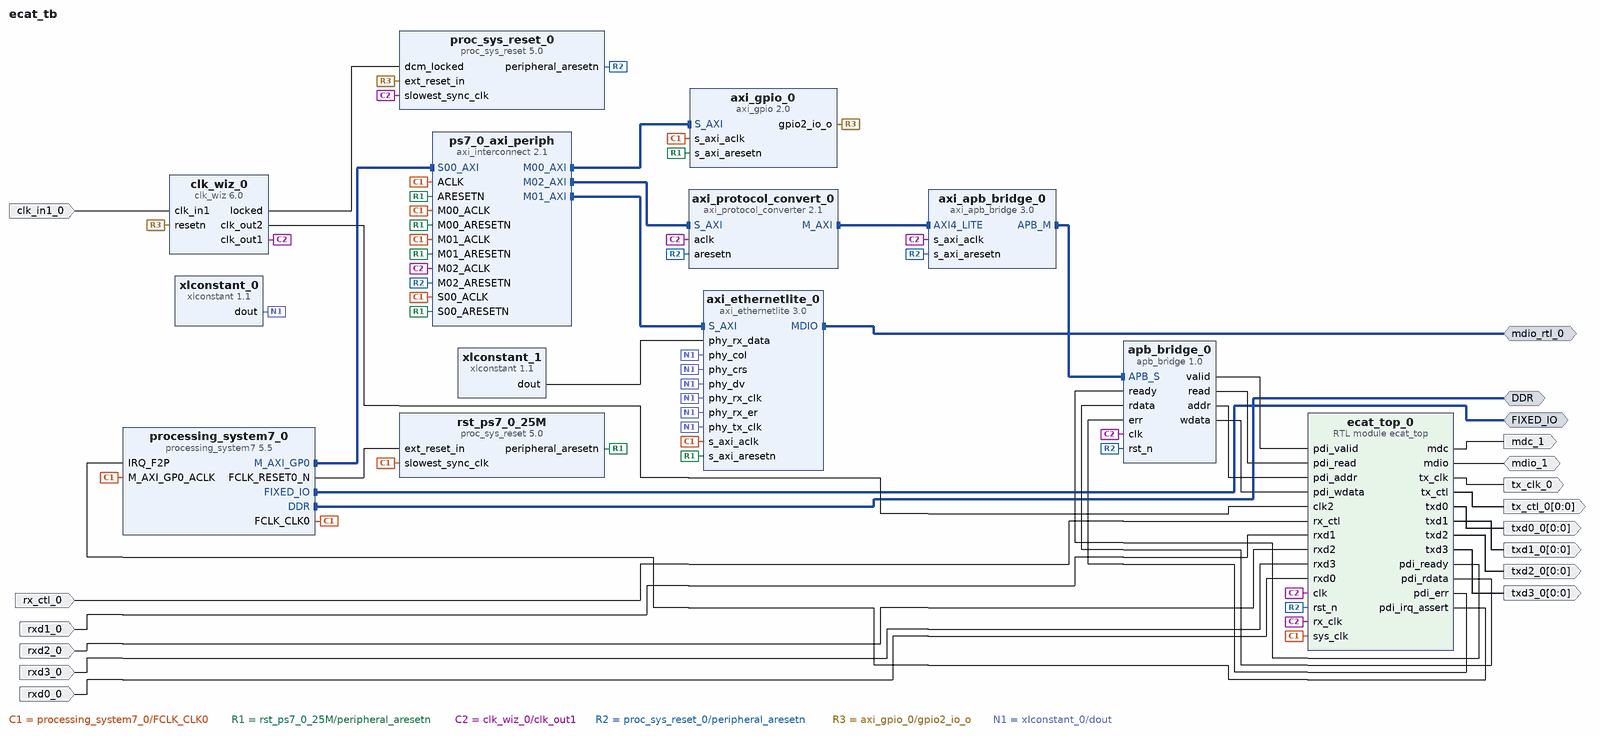
[diagram p0: block diagram of the top level]
# Vivado block design ecat_tb, xc7z020clg400-2, Vivado 2019.1
create_bd_design ecat_tb

create_bd_intf_port -mode Master -vlnv xilinx.com:interface:ddrx_rtl:1.0 DDR
create_bd_intf_port -mode Master -vlnv xilinx.com:display_processing_system7:fixedio_rtl:1.0 FIXED_IO
create_bd_intf_port -mode Master -vlnv xilinx.com:interface:mdio_rtl:1.0 mdio_rtl_0
create_bd_port -dir I -type clk clk_in1_0
set_property -dict {CONFIG.FREQ_HZ 25000000} [get_bd_ports clk_in1_0]
create_bd_port -dir I rx_ctl_0
create_bd_port -dir I rxd0_0
create_bd_port -dir I rxd1_0
create_bd_port -dir I rxd2_0
create_bd_port -dir I rxd3_0
create_bd_port -dir O -type clk tx_clk_0
create_bd_port -dir O -from 0 -to 0 tx_ctl_0
create_bd_port -dir O -from 0 -to 0 txd0_0
create_bd_port -dir O -from 0 -to 0 txd1_0
create_bd_port -dir O -from 0 -to 0 txd2_0
create_bd_port -dir O -from 0 -to 0 txd3_0
create_bd_port -dir O mdc_1
create_bd_port -dir IO mdio_1

create_bd_cell -type ip -vlnv xilinx.com:ip:processing_system7:5.5 processing_system7_0
set_property -dict [list \
  CONFIG.PCW_FPGA0_PERIPHERAL_FREQMHZ 25 \
  CONFIG.PCW_IRQ_F2P_INTR 1 \
  CONFIG.PCW_PRESET_BANK1_VOLTAGE {LVCMOS 1.8V} \
  CONFIG.PCW_UART1_PERIPHERAL_ENABLE 1 \
  CONFIG.PCW_UART1_UART1_IO {MIO 48 .. 49} \
  CONFIG.PCW_UART_PERIPHERAL_FREQMHZ 100 \
  CONFIG.PCW_UIPARAM_DDR_PARTNO {MT41K256M16 RE-125} \
  CONFIG.PCW_USE_FABRIC_INTERRUPT 1 \
] [get_bd_cells processing_system7_0]
# 41 more settings of processing_system7_0 are not shown: defaults, MIO pin electricals, DDR timing, and values the tool derives
create_bd_cell -type ip -vlnv xilinx.com:ip:axi_gpio:2.0 axi_gpio_0
set_property -dict [list \
  CONFIG.C_ALL_OUTPUTS 1 \
  CONFIG.C_ALL_OUTPUTS_2 1 \
  CONFIG.C_GPIO2_WIDTH 1 \
  CONFIG.C_GPIO_WIDTH 1 \
  CONFIG.C_IS_DUAL 1 \
] [get_bd_cells axi_gpio_0]
create_bd_cell -type ip -vlnv xilinx.com:ip:axi_interconnect:2.1 ps7_0_axi_periph
set_property -dict {CONFIG.NUM_MI 3} [get_bd_cells ps7_0_axi_periph]
create_bd_cell -type ip -vlnv xilinx.com:ip:proc_sys_reset:5.0 rst_ps7_0_25M
create_bd_cell -type ip -vlnv xilinx.com:ip:clk_wiz:6.0 clk_wiz_0
set_property -dict [list \
  CONFIG.CLKIN1_JITTER_PS 400.0 \
  CONFIG.CLKOUT1_DRIVES BUFG \
  CONFIG.CLKOUT1_JITTER 432.605 \
  CONFIG.CLKOUT1_PHASE_ERROR 258.220 \
  CONFIG.CLKOUT1_REQUESTED_OUT_FREQ 25 \
  CONFIG.CLKOUT2_DRIVES BUFG \
  CONFIG.CLKOUT2_JITTER 342.952 \
  CONFIG.CLKOUT2_PHASE_ERROR 258.220 \
  CONFIG.CLKOUT2_REQUESTED_OUT_FREQ 50 \
  CONFIG.CLKOUT2_USED true \
  CONFIG.CLKOUT3_DRIVES BUFG \
  CONFIG.CLKOUT3_JITTER 206.578 \
  CONFIG.CLKOUT3_PHASE_ERROR 237.727 \
  CONFIG.CLKOUT3_REQUESTED_OUT_FREQ 200 \
  CONFIG.CLKOUT3_USED false \
  CONFIG.CLKOUT4_DRIVES BUFG \
  CONFIG.CLKOUT5_DRIVES BUFG \
  CONFIG.CLKOUT6_DRIVES BUFG \
  CONFIG.CLKOUT7_DRIVES BUFG \
  CONFIG.MMCM_BANDWIDTH OPTIMIZED \
  CONFIG.MMCM_CLKFBOUT_MULT_F 34 \
  CONFIG.MMCM_CLKIN1_PERIOD 40.000 \
  CONFIG.MMCM_CLKIN2_PERIOD 10.0 \
  CONFIG.MMCM_CLKOUT0_DIVIDE_F 34 \
  CONFIG.MMCM_CLKOUT1_DIVIDE 17 \
  CONFIG.MMCM_CLKOUT2_DIVIDE 1 \
  CONFIG.MMCM_COMPENSATION ZHOLD \
  CONFIG.NUM_OUT_CLKS 2 \
  CONFIG.PRIMITIVE PLL \
  CONFIG.PRIM_IN_FREQ 25 \
  CONFIG.RESET_PORT resetn \
  CONFIG.RESET_TYPE ACTIVE_LOW \
] [get_bd_cells clk_wiz_0]
create_bd_cell -type ip -vlnv xilinx.com:ip:proc_sys_reset:5.0 proc_sys_reset_0
create_bd_cell -type ip -vlnv xilinx.com:ip:axi_ethernetlite:3.0 axi_ethernetlite_0
set_property -dict {CONFIG.C_RX_PING_PONG 0 CONFIG.C_TX_PING_PONG 0} [get_bd_cells axi_ethernetlite_0]
create_bd_cell -type ip -vlnv xilinx.com:ip:xlconstant:1.1 xlconstant_0
set_property -dict {CONFIG.CONST_VAL 0 CONFIG.CONST_WIDTH 1} [get_bd_cells xlconstant_0]
create_bd_cell -type ip -vlnv xilinx.com:ip:xlconstant:1.1 xlconstant_1
set_property -dict {CONFIG.CONST_VAL 0 CONFIG.CONST_WIDTH 4} [get_bd_cells xlconstant_1]
create_bd_cell -type ip -vlnv xilinx.com:ip:axi_apb_bridge:3.0 axi_apb_bridge_0
set_property -dict {CONFIG.C_APB_NUM_SLAVES 1} [get_bd_cells axi_apb_bridge_0]
create_bd_cell -type ip -vlnv xilinx.com:ip:axi_protocol_converter:2.1 axi_protocol_convert_0
set_property -dict [list \
  CONFIG.DATA_WIDTH 32 \
  CONFIG.MI_PROTOCOL AXI4LITE \
  CONFIG.SI_PROTOCOL AXI4 \
  CONFIG.TRANSLATION_MODE 2 \
] [get_bd_cells axi_protocol_convert_0]
create_bd_cell -type ip -vlnv xilinx.com:user:apb_bridge:1.0 apb_bridge_0
create_bd_cell -type module -reference ecat_top ecat_top_0

# ---- connections ----

connect_bd_intf_net [get_bd_intf_pins axi_protocol_convert_0/M_AXI] [get_bd_intf_pins axi_apb_bridge_0/AXI4_LITE]
connect_bd_intf_net [get_bd_intf_pins ps7_0_axi_periph/M00_AXI] [get_bd_intf_pins axi_gpio_0/S_AXI]
connect_bd_intf_net [get_bd_intf_ports mdio_rtl_0] [get_bd_intf_pins axi_ethernetlite_0/MDIO]
connect_bd_intf_net [get_bd_intf_ports FIXED_IO] [get_bd_intf_pins processing_system7_0/FIXED_IO]
connect_bd_intf_net [get_bd_intf_pins processing_system7_0/M_AXI_GP0] [get_bd_intf_pins ps7_0_axi_periph/S00_AXI]
connect_bd_intf_net [get_bd_intf_pins ps7_0_axi_periph/M02_AXI] [get_bd_intf_pins axi_protocol_convert_0/S_AXI]
connect_bd_intf_net [get_bd_intf_pins axi_apb_bridge_0/APB_M] [get_bd_intf_pins apb_bridge_0/APB_S]
connect_bd_intf_net [get_bd_intf_ports DDR] [get_bd_intf_pins processing_system7_0/DDR]
connect_bd_intf_net [get_bd_intf_pins ps7_0_axi_periph/M01_AXI] [get_bd_intf_pins axi_ethernetlite_0/S_AXI]
connect_bd_net [get_bd_pins processing_system7_0/FCLK_CLK0] \
  [get_bd_pins processing_system7_0/M_AXI_GP0_ACLK] [get_bd_pins ps7_0_axi_periph/S00_ACLK] \
  [get_bd_pins rst_ps7_0_25M/slowest_sync_clk] [get_bd_pins axi_gpio_0/s_axi_aclk] [get_bd_pins ps7_0_axi_periph/M00_ACLK] \
  [get_bd_pins ps7_0_axi_periph/ACLK] [get_bd_pins ps7_0_axi_periph/M01_ACLK] [get_bd_pins axi_ethernetlite_0/s_axi_aclk] \
  [get_bd_pins ecat_top_0/sys_clk]
connect_bd_net [get_bd_pins processing_system7_0/FCLK_RESET0_N] [get_bd_pins rst_ps7_0_25M/ext_reset_in]
connect_bd_net [get_bd_pins rst_ps7_0_25M/peripheral_aresetn] \
  [get_bd_pins ps7_0_axi_periph/S00_ARESETN] [get_bd_pins axi_gpio_0/s_axi_aresetn] \
  [get_bd_pins ps7_0_axi_periph/M00_ARESETN] [get_bd_pins ps7_0_axi_periph/ARESETN] \
  [get_bd_pins ps7_0_axi_periph/M01_ARESETN] [get_bd_pins axi_ethernetlite_0/s_axi_aresetn]
connect_bd_net [get_bd_pins clk_wiz_0/clk_out1] \
  [get_bd_pins proc_sys_reset_0/slowest_sync_clk] [get_bd_pins ps7_0_axi_periph/M02_ACLK] \
  [get_bd_pins axi_apb_bridge_0/s_axi_aclk] [get_bd_pins axi_protocol_convert_0/aclk] [get_bd_pins apb_bridge_0/clk] \
  [get_bd_pins ecat_top_0/rx_clk] [get_bd_pins ecat_top_0/clk]
connect_bd_net [get_bd_pins clk_wiz_0/locked] [get_bd_pins proc_sys_reset_0/dcm_locked]
connect_bd_net [get_bd_pins proc_sys_reset_0/peripheral_aresetn] \
  [get_bd_pins ps7_0_axi_periph/M02_ARESETN] [get_bd_pins axi_apb_bridge_0/s_axi_aresetn] \
  [get_bd_pins axi_protocol_convert_0/aresetn] [get_bd_pins apb_bridge_0/rst_n] [get_bd_pins ecat_top_0/rst_n]
connect_bd_net -net clk_in1_0_1 [get_bd_ports clk_in1_0] [get_bd_pins clk_wiz_0/clk_in1]
connect_bd_net [get_bd_pins axi_gpio_0/gpio2_io_o] [get_bd_pins clk_wiz_0/resetn] [get_bd_pins proc_sys_reset_0/ext_reset_in]
connect_bd_net -net rx_ctl_0_1 [get_bd_ports rx_ctl_0] [get_bd_pins ecat_top_0/rx_ctl]
connect_bd_net -net rxd1_0_1 [get_bd_ports rxd1_0] [get_bd_pins ecat_top_0/rxd1]
connect_bd_net -net rxd2_0_1 [get_bd_ports rxd2_0] [get_bd_pins ecat_top_0/rxd2]
connect_bd_net -net rxd3_0_1 [get_bd_ports rxd3_0] [get_bd_pins ecat_top_0/rxd3]
connect_bd_net [get_bd_pins ecat_top_0/tx_clk] [get_bd_ports tx_clk_0]
connect_bd_net [get_bd_pins ecat_top_0/mdc] [get_bd_ports mdc_1]
connect_bd_net [get_bd_ports mdio_1] [get_bd_pins ecat_top_0/mdio]
connect_bd_net [get_bd_pins xlconstant_0/dout] \
  [get_bd_pins axi_ethernetlite_0/phy_col] [get_bd_pins axi_ethernetlite_0/phy_crs] \
  [get_bd_pins axi_ethernetlite_0/phy_rx_clk] [get_bd_pins axi_ethernetlite_0/phy_dv] \
  [get_bd_pins axi_ethernetlite_0/phy_rx_er] [get_bd_pins axi_ethernetlite_0/phy_tx_clk]
connect_bd_net [get_bd_pins xlconstant_1/dout] [get_bd_pins axi_ethernetlite_0/phy_rx_data]
connect_bd_net [get_bd_pins clk_wiz_0/clk_out2] [get_bd_pins ecat_top_0/clk2]
connect_bd_net -net rxd0_0_1 [get_bd_ports rxd0_0] [get_bd_pins ecat_top_0/rxd0]
connect_bd_net [get_bd_pins ecat_top_0/tx_ctl] [get_bd_ports tx_ctl_0]
connect_bd_net [get_bd_pins ecat_top_0/txd0] [get_bd_ports txd0_0]
connect_bd_net [get_bd_pins ecat_top_0/txd1] [get_bd_ports txd1_0]
connect_bd_net [get_bd_pins ecat_top_0/txd2] [get_bd_ports txd2_0]
connect_bd_net [get_bd_pins ecat_top_0/txd3] [get_bd_ports txd3_0]
connect_bd_net [get_bd_pins apb_bridge_0/valid] [get_bd_pins ecat_top_0/pdi_valid]
connect_bd_net [get_bd_pins apb_bridge_0/read] [get_bd_pins ecat_top_0/pdi_read]
connect_bd_net [get_bd_pins apb_bridge_0/addr] [get_bd_pins ecat_top_0/pdi_addr]
connect_bd_net [get_bd_pins apb_bridge_0/wdata] [get_bd_pins ecat_top_0/pdi_wdata]
connect_bd_net [get_bd_pins ecat_top_0/pdi_ready] [get_bd_pins apb_bridge_0/ready]
connect_bd_net [get_bd_pins ecat_top_0/pdi_irq_assert] [get_bd_pins processing_system7_0/IRQ_F2P]
connect_bd_net [get_bd_pins ecat_top_0/pdi_rdata] [get_bd_pins apb_bridge_0/rdata]
connect_bd_net [get_bd_pins ecat_top_0/pdi_err] [get_bd_pins apb_bridge_0/err]

# ---- address map ----
assign_bd_address -offset 0x40E00000 -range 64K -target_address_space [get_bd_addr_spaces processing_system7_0/Data] [get_bd_addr_segs axi_ethernetlite_0/S_AXI/Reg]
assign_bd_address -offset 0x41200000 -range 64K -target_address_space [get_bd_addr_spaces processing_system7_0/Data] [get_bd_addr_segs axi_gpio_0/S_AXI/Reg]
assign_bd_address -offset 0x43C00000 -range 64K -target_address_space [get_bd_addr_spaces processing_system7_0/Data] [get_bd_addr_segs apb_bridge_0/APB_S/Reg]

validate_bd_design
save_bd_design
